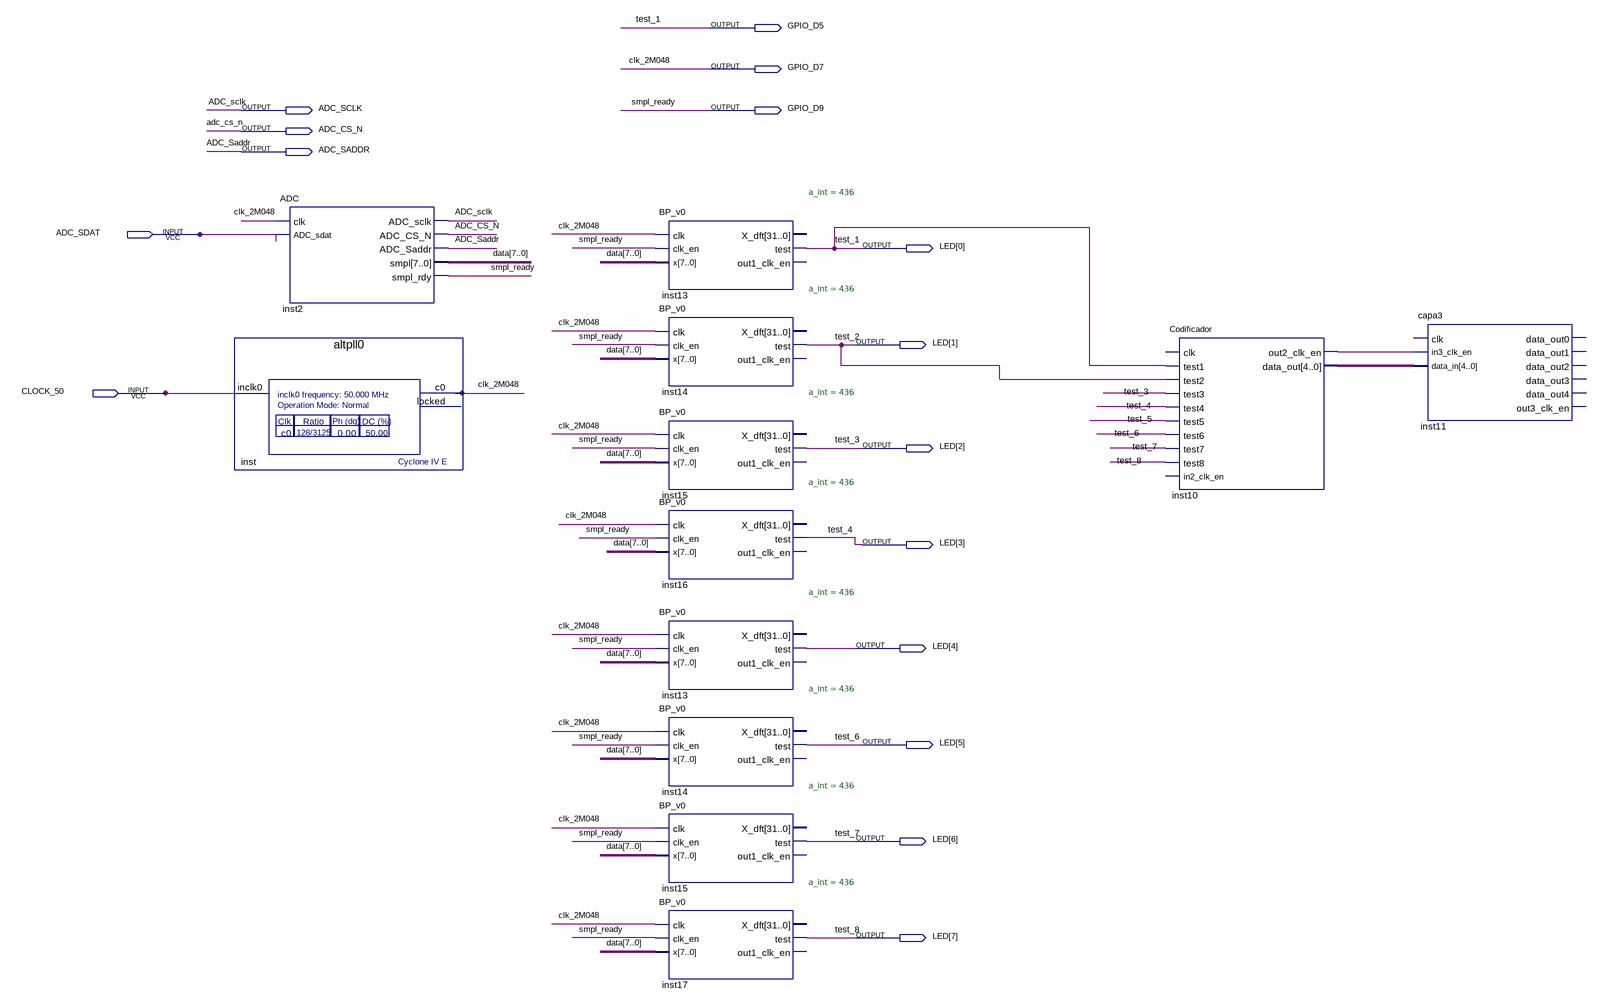
[diagram p0: schematic sheet]
// Quartus schematic main.bdf as structural Verilog: 12 symbols, 16 pins
module main (
  input  ADC_SDAT,
  input  CLOCK_50,
  output GPIO_D5,
  output GPIO_D7,
  output ADC_SCLK,
  output GPIO_D9,
  output ADC_CS_N,
  output ADC_SADDR,
  output [7:0] LED
);

  wire inst10_out2_clk_en, test_5;
  wire [4:0] inst10_data_out;
  wire [7:0] data;

  ADC inst2 (
    .clk(GPIO_D7), .ADC_sdat(ADC_SDAT), .ADC_sclk(ADC_SCLK), .ADC_CS_N(ADC_CS_N), .ADC_Saddr(ADC_SADDR),
    .smpl(data), .smpl_rdy(GPIO_D9));
  altpll0 inst (.inclk0(CLOCK_50), .c0(GPIO_D7));  // open: locked
  BP_v0 #(.a_int(436)) inst13 (.clk(GPIO_D7), .clk_en(GPIO_D9), .x(data), .test(GPIO_D5));  // open: X_dft, out1_clk_en
  BP_v0 #(.a_int(436)) inst14 (.clk(GPIO_D7), .clk_en(GPIO_D9), .x(data), .test(LED[1]));  // open: X_dft, out1_clk_en
  BP_v0 #(.a_int(436)) inst15 (.clk(GPIO_D7), .clk_en(GPIO_D9), .x(data), .test(LED[2]));  // open: X_dft, out1_clk_en
  BP_v0 #(.a_int(436)) inst16 (.clk(GPIO_D7), .clk_en(GPIO_D9), .x(data), .test(LED[3]));  // open: X_dft, out1_clk_en
  BP_v0 #(.a_int(436)) inst13_dup2 (
    .clk(GPIO_D7), .clk_en(GPIO_D9), .x(data), .test(LED[4]));  // open: X_dft, out1_clk_en
  BP_v0 #(.a_int(436)) inst14_dup2 (
    .clk(GPIO_D7), .clk_en(GPIO_D9), .x(data), .test(LED[5]));  // open: X_dft, out1_clk_en
  BP_v0 #(.a_int(436)) inst15_dup2 (
    .clk(GPIO_D7), .clk_en(GPIO_D9), .x(data), .test(LED[6]));  // open: X_dft, out1_clk_en
  BP_v0 #(.a_int(436)) inst17 (.clk(GPIO_D7), .clk_en(GPIO_D9), .x(data), .test(LED[7]));  // open: X_dft, out1_clk_en
  Codificador inst10 (
    .test1(GPIO_D5), .test2(LED[1]), .test3(LED[2]), .test4(LED[3]), .test5(test_5), .test6(LED[5]),
    .test7(LED[6]), .test8(LED[7]), .out2_clk_en(inst10_out2_clk_en), .data_out(inst10_data_out));  // open: clk, in2_clk_en
  capa3 inst11 (
    .in3_clk_en(inst10_out2_clk_en), .data_in(inst10_data_out));  // open: clk, data_out0, data_out1, data_out2, data_out3, data_out4, out3_clk_en

  assign LED[0] = GPIO_D5;

  // Other names for the same wires on the sheet: clk_2M048 = GPIO_D7; test_4 = LED[3]; smpl_ready = GPIO_D9;
  //   test_1 = GPIO_D5; test_2 = LED[1]; test_3 = LED[2]; test_6 = LED[5]; test_7 = LED[6]; test_8 = LED[7]
endmodule
